# EAGLE design DCC fDecoder (EAGLE 9.6.2)
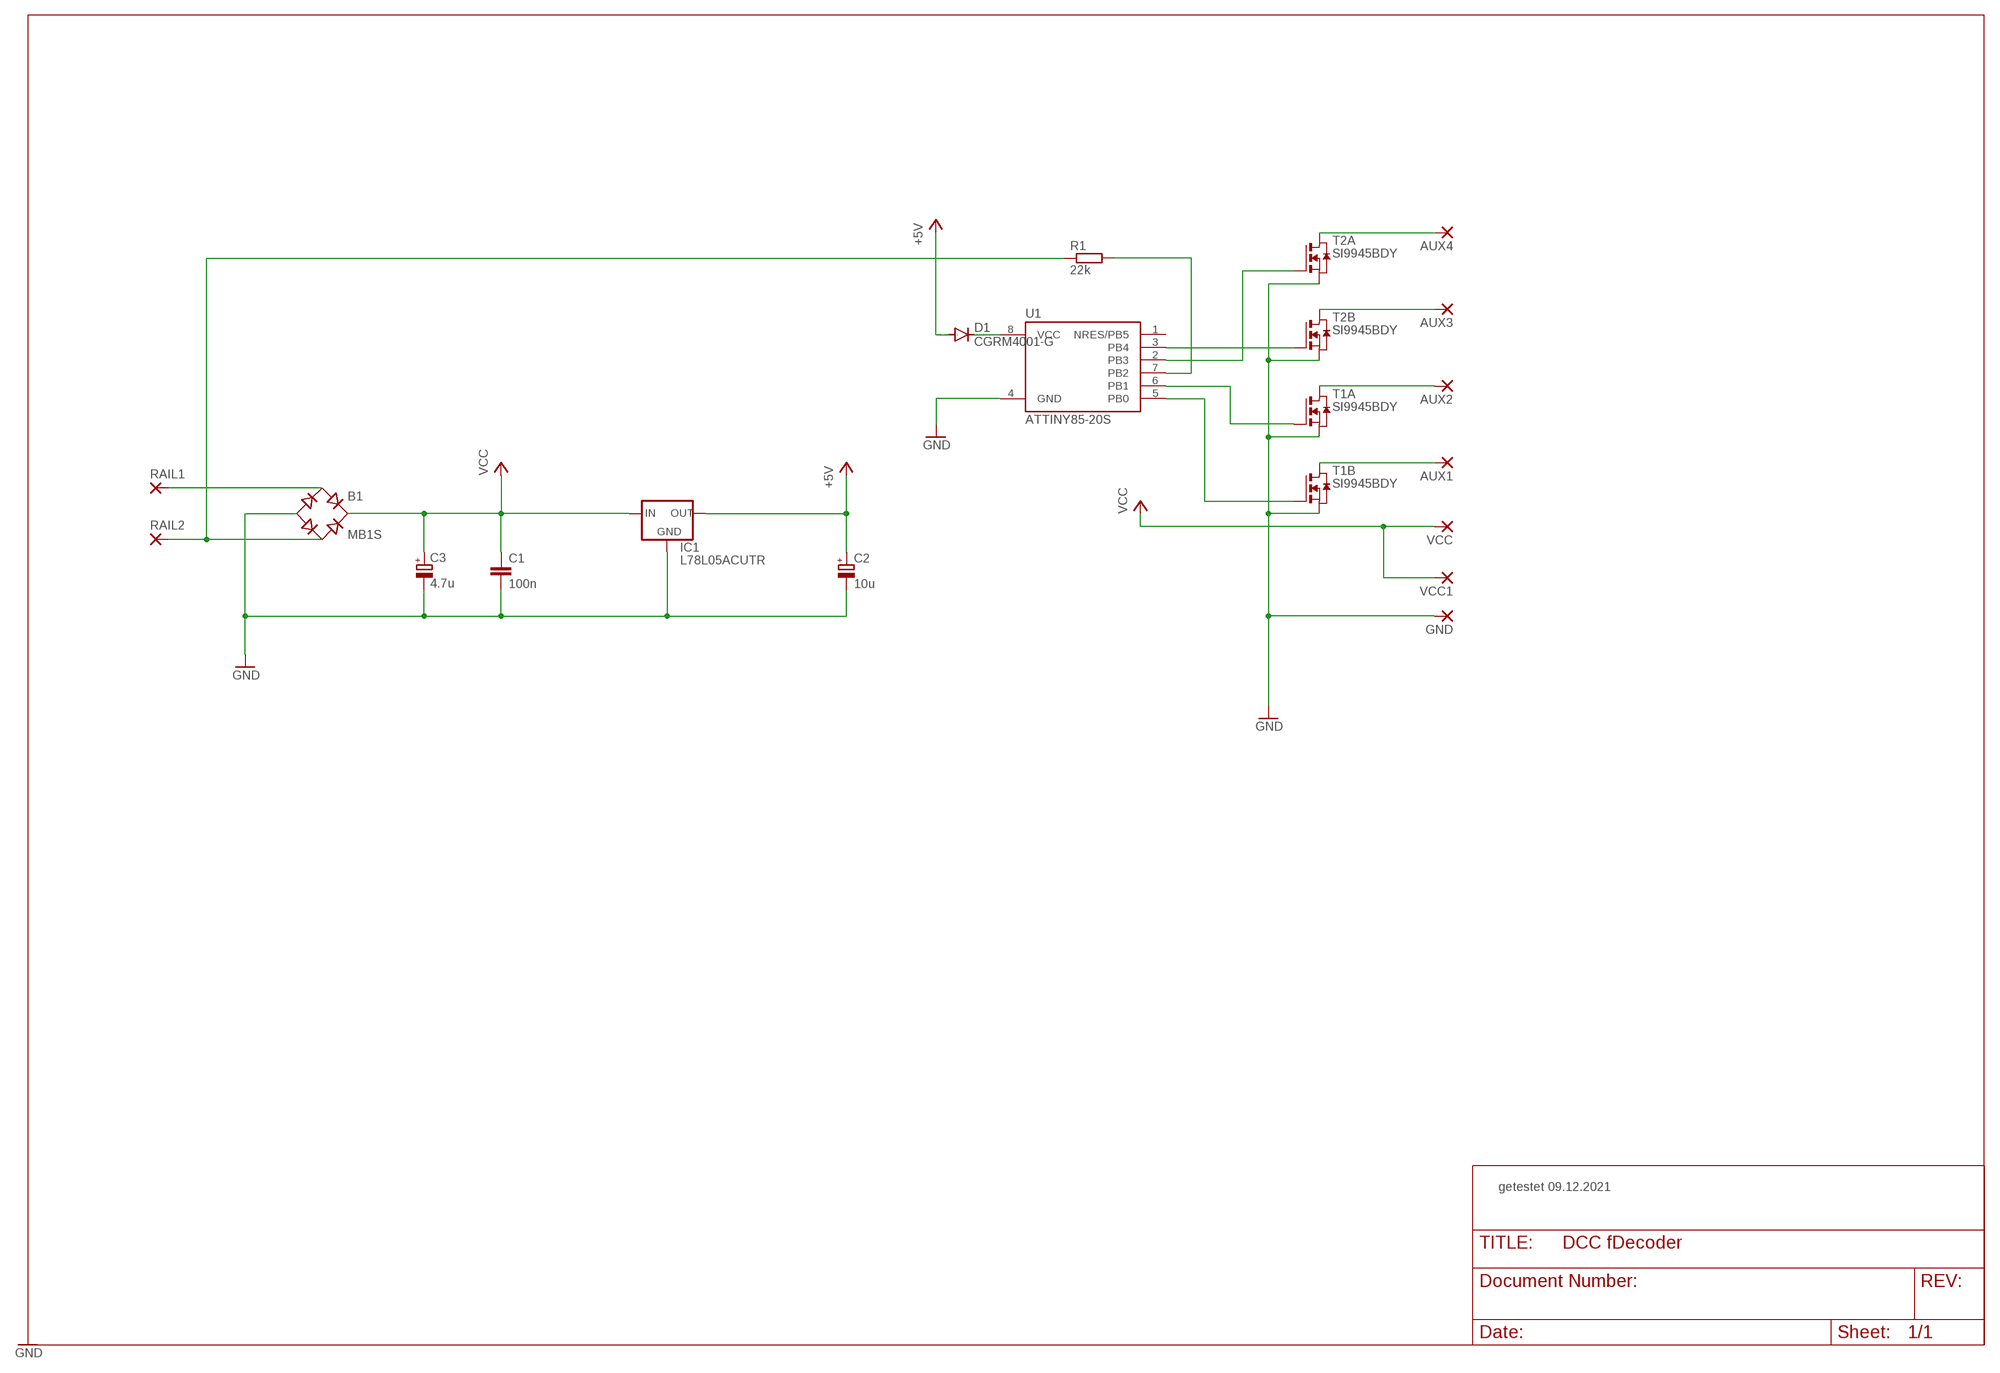
[diagram p0: schematic, sheet 1]

## Parts
AUX1  SMD2  [SMD1,27-2,54]
AUX2  SMD2  [SMD1,27-2,54]
AUX3  SMD2  [SMD1,27-2,54]
AUX4  SMD2  [SMD1,27-2,54]
B1  MB1S  [SOIC-4]
C1  100n  C-EUC0805  [C0805]
C2  10u  CPOL-EUA/3216-18W  [A/3216-18W]
C3  4.7u  CPOL-EUA/3216-18W  [A/3216-18W]
D1  CGRM4001-G  [SOD-123_MINI-SMA]
GND  SMD2  [SMD1,27-2,54]
IC1  L78L05ACUTR  [SOT89R]
R1  22k  R-EU_R0805  [R0805]
RAIL1  SMD2  [SMD1,27-2,54]
RAIL2  SMD2  [SMD1,27-2,54]
T1  SI9945BDY  NMOS2SO8  [SO8]
T2  SI9945BDY  NMOS2SO8  [SO8]
U1  ATTINY85-20S  [SOIC8_EIAJ_208MIL]
VCC  SMD2  [SMD1,27-2,54]
VCC1  SMD2  [SMD1,27-2,54]

## Nets
+5V: C2.+ D1.A IC1.2(OUT)
GND: B1.- C1.2 C2.- C3.- GND.1(P) IC1.3(GND) IC1.4(GND) T1.1(A:S) T1.3(B:S) T2.1(A:S) T2.3(B:S) U1.4(GND)
N$1: AUX1.1(P) T1.5(B:D) T1.6(B:D)
N$2: AUX4.1(P) T2.7(A:D) T2.8(A:D)
N$3: AUX3.1(P) T2.5(B:D) T2.6(B:D)
N$4: AUX2.1(P) T1.7(A:D) T1.8(A:D)
N$5: T1.4(B:G) U1.5(PB0)
N$6: T1.2(A:G) U1.6(PB1)
N$7: T2.2(A:G) U1.2(PB3)
N$8: T2.4(B:G) U1.3(PB4)
N$9: D1.C U1.8(VCC)
N$10: B1.~2(AC2) R1.1 RAIL2.1(P)
N$11: R1.2 U1.7(PB2)
N$12: B1.~1(AC1) RAIL1.1(P)
VCC: B1.+ C1.1 C3.+ IC1.1(IN) VCC1.1(P) VCC.1(P)
Unconnected: U1.1(NRES/PB5)

## Notes on the sheet
- getestet 09.12.2021

## Library data of the parts
AUX1-AUX4 GND RAIL1 RAIL2 VCC VCC1 = wirepad:SMD2: SMD PAD
B1 = rectifier:MB*S: Bridge Rectifier Source: http://www.fairchildsemi.com/ds/MB/MB6S.pdf
C1 = rcl:C-EU: CAPACITOR, European symbol
C2 C3 = rcl:CPOL-EU: POLARIZED CAPACITOR, European symbol
D1 = diode:CGRM400*-G: Molded plasitc,JEDEC SOD-123/Mini SMA Source: Comchip CGRM4001-G.pdf
IC1 = _smd:L78L05ACUTR
R1 = rcl:R-EU_: RESISTOR, European symbol
T1 T2 = zetex:NMOS2: Dual MOS FET; OC_FARNELL: unknown; OC_NEWARK: unknown
U1 = attiny25_45_85:ATTINY85*: ATMEL ATtiny 85 Packages: P = PDIP 08 30mil S = SOIC 08 EIAJ 208mil Technologies Note: for complete ordering code (temp. range, finish, tape&reel etc.) see www.atmel.com • Supply Voltage: V = (1.8…5.5)V | [blank] = (2.7…5.5)V • Speed: 10 = 10 MHz | 20 = 20 MHz Author: Dipl.-Ing. FH Rainer Bayer HHN Hochschule Heilbronn (Heilbronn University), rainer.bayer@hs-heilbronn.de Ingenieurbüro ing-rb, mail@ing-rb.de

## Board
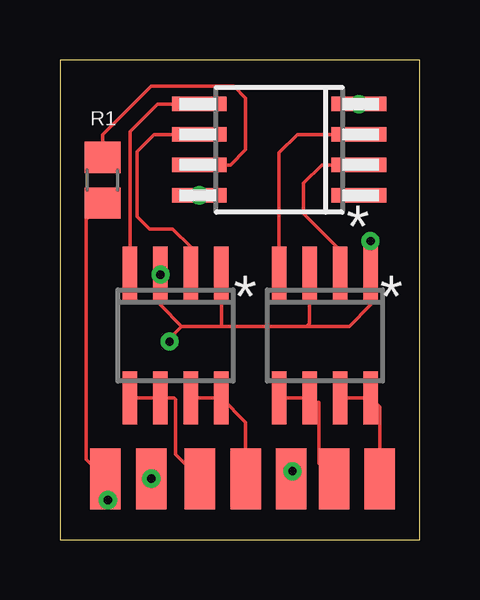
[diagram p1: board, top side]
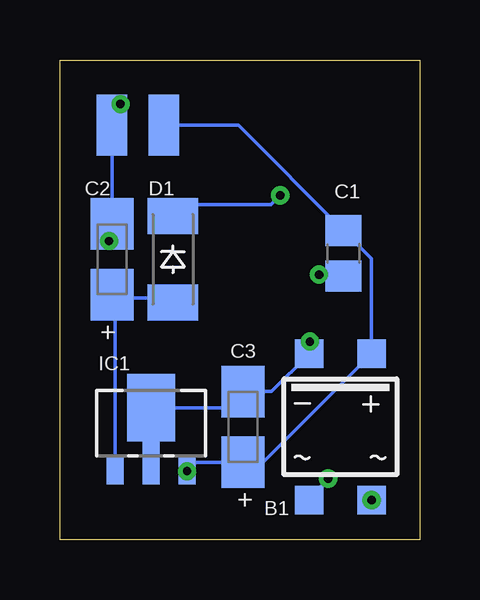
[diagram p2: board, bottom side, seen from below]

Size 15 x 20 mm. Coordinates in mm from the lower left corner, seen from the top.
Outline: 0,0 15,0 15,20 0,20 0,0
Copper layers (1*16): Top 0.035mm / dielectric 1.5mm / Bottom 0.035mm
Design rules "default": minimum track width 6mil, minimum drill 0.35mm, track to track 6mil, track to pad 6mil, pad to pad 6mil, via to via 6mil, smd to smd 6mil, copper to edge 40mil, drill to drill 6mil, minimum pad ring 10mil, minimum via ring 8mil, stop-mask expansion 4mil, vias tented up to drill 0mil, thermal gap 10mil

### Footprints (pad centres in the part's own frame; a part is rotated, then mirrored left to right if it is on the bottom)
SMD1,27-2,54 = smd 1.27 x 2.54: 1 0,0
SOIC-4 = smd 1.2 x 1.2: + 1.3,3.05; - -1.3,3.05; ~1 -1.3,-3.05; ~2 1.3,-3.05
C0805 = smd 1.3 x 1.5: 1 -0.95,0; 2 0.95,0
A/3216-18W = smd 2.15 x 1.8: + 1.475,0; - -1.475,0
SOD-123_MINI-SMA = smd 1.5 x 2.1: A 1.8,0; C -1.8,0
SOT89R = smd 0.7 x 1.1: 1 1.5,-1.75; 2 -1.5,-1.75 | smd 0.7 x 1.8: 3 0,-1.4 | smd 2 x 2.8: 4 0,0.9
R0805 = smd 1.3 x 1.5: 1 -0.95,0; 2 0.95,0
SO8 = smd 0.6 x 2.2: 1 -1.905,-2.6; 2 -0.635,-2.6; 3 0.635,-2.6; 4 1.905,-2.6; 5 1.905,2.6; 6 0.635,2.6; 7 -0.635,2.6; 8 -1.905,2.6
SOIC8_EIAJ_208MIL = smd 0.6 x 2.286: 1 -1.905,-3.33; 2 -0.635,-3.33; 3 0.635,-3.33; 4 1.905,-3.33; 5 1.905,3.33; 6 0.635,3.33; 7 -0.635,3.33; 8 -1.905,3.33

### Placement (x,y rotation side)
AUX1  5.84,2.54 180 top
AUX2  7.75,2.54 180 top
AUX3  11.43,2.54 180 top
AUX4  13.34,2.54 180 top
B1  3.3,4.7 0 bottom
C1  3.17,11.94 270 bottom
C2  12.83,11.68 270 bottom
C3  7.37,4.7 270 bottom
D1  10.29,11.68 270 bottom
GND  12.83,17.27 0 bottom
IC1  11.2,4.6 0 bottom
R1  1.78,14.99 90 top
RAIL1  3.81,2.54 180 top
RAIL2  1.91,2.54 180 top
T1  4.83,8.51 180 top
T2  11.05,8.51 180 top
U1  9.14,16.26 90 top
VCC  9.65,2.54 180 top
VCC1  10.67,17.27 0 bottom

### Tracks (layer width: path | path; a pad name or v marks a point on that pad's centre or on a via)
+5V
  Bottom 0.152: IC1.2 12.7,10.08 | 12.7,10.08 C2.+ | D1.A 10.48,10.08 12.7,10.08
GND  (via drill 0.35)
  Top 0.152: v12.95,12.45 T2.1 12.95,9.78 12.06,8.89 10.29,8.89 | T1.3 v4.19,11.05 4.19,9.78 5.08,8.89 | 6.73,8.89 5.08,8.89 | 6.73,8.89 10.29,8.89 | T2.3 10.41,9.02 10.29,8.89 | T1.1 6.73,8.89 | 5.08,8.89 4.57,8.38 v4.57,8.26
  Bottom 0.152: v12.95,12.45 12.83,12.57 C2.- GND.1 12.47,17.62 U1.4 | v4.57,8.26 4.6,8.22 B1.- 6.18,6.17 C3.- 8.04,5.5 IC1.4 IC1.3 | C1.2 4.13,10.99 v4.19,11.05
  other vias: 12.47,18.16
N$1
  Top 0.152: AUX1.1 4.83,3.56 4.83,5.84 4.76,5.91 T1.6 T1.5
N$2
  Top 0.152: AUX4.1 13.34,5.53 T2.8 T2.7
N$3
  Top 0.152: AUX3.1 10.79,3.17 10.79,5.71 10.61,5.71 T2.6 T2.5
N$4
  Top 0.152: AUX2.1 7.75,4.89 T1.8 T1.7
N$5
  Top 0.152: T1.4 2.92,17.02 4.06,18.16 U1.5
N$6
  Top 0.152: 5.33,11.24 T1.2 5.46,12.19 4.7,12.95 3.73,12.95 3.23,13.46 3.23,16.18 3.94,16.89 U1.6
N$7
  Top 0.152: T2.2 11.68,12.06 10.16,13.59 10.16,14.86 10.92,15.62 U1.2
N$8
  Top 0.152: T2.4 9.14,16.13 9.91,16.89 U1.3
N$9  (via drill 0.35)
  Bottom 0.152: D1.C 9.8,13.97 6.2,13.97 U1.8
  other vias: 5.81,14.35
N$10  (via drill 0.35)
  Top 0.152: R1.1 1.09,13.35 1.09,3.35 RAIL2.1 2,2.44 B1.~2
  other vias: 2,1.65
N$11
  Top 0.152: 2.09,15.62 R1.2 1.78,16.88 3.81,18.91 7.25,18.91 7.75,18.41 7.75,16.26 7.11,15.62 U1.7
N$12  (via drill 0.35)
  Bottom 0.152: RAIL1.1 4.6,1.75 B1.~1
  other vias: 3.81,2.54
VCC  (via drill 0.35)
  Top 0.152: VCC.1 9.65,2.8 IC1.1
  Bottom 0.152: IC1.1 9.33,3.22 C3.+ 6.53,3.22 B1.+ 2,11.71 C1.1 7.56,17.27 VCC1.1
  other vias: 9.7,2.85

### Text on the board
tPlace: * | * | *
bNames: + | +
tDocu: fDecoder - 14.09.2020 - v2 AZ | Rail | Rail | AUX1 | AUX2 | VCC | AUX3 | AUX4
bDocu: VCC | GND